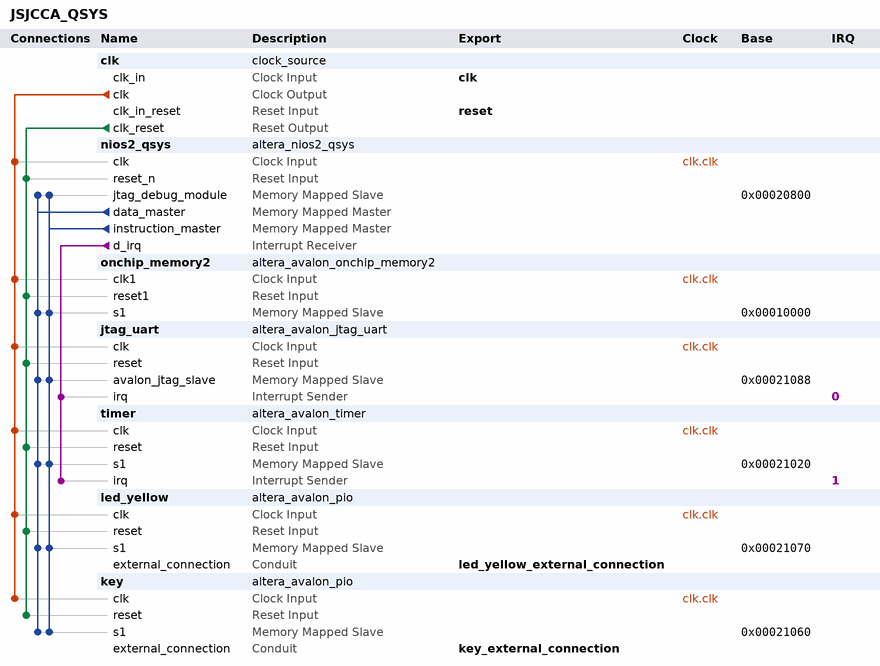
[diagram p0: system contents]
# Platform Designer (Qsys) system JSJCCA_QSYS, Cyclone IV E EP4CE6E22C8
# Parameters at their usual value, and those the tool derives, are not listed.
package require -exact qsys 13.0.1.99.2
create_system JSJCCA_QSYS
set_project_property DEVICE_FAMILY {Cyclone IV E}
set_project_property DEVICE EP4CE6E22C8

add_instance clk clock_source 13.0
set_instance_parameter_value clk clockFrequency 50000000

add_instance nios2_qsys altera_nios2_qsys 13.0
set_instance_parameter_value nios2_qsys resetSlave onchip_memory2.s1
set_instance_parameter_value nios2_qsys mmu_TLBMissExcSlave None
set_instance_parameter_value nios2_qsys exceptionSlave onchip_memory2.s1
set_instance_parameter_value nios2_qsys breakSlave nios2_qsys.jtag_debug_module
set_instance_parameter_value nios2_qsys impl Tiny
set_instance_parameter_value nios2_qsys icache_size 4096

add_instance onchip_memory2 altera_avalon_onchip_memory2 13.0.1.99.2
set_instance_parameter_value onchip_memory2 dataWidth 32
set_instance_parameter_value onchip_memory2 dualPort false
set_instance_parameter_value onchip_memory2 initMemContent true
set_instance_parameter_value onchip_memory2 initializationFileName onchip_mem.hex
set_instance_parameter_value onchip_memory2 memorySize 8960

add_instance jtag_uart altera_avalon_jtag_uart 13.0.1.99.2
set_instance_parameter_value jtag_uart simInteractiveOptions NO_INTERACTIVE_WINDOWS

add_instance timer altera_avalon_timer 13.0.1.99.2
set_instance_parameter_value timer period 1
set_instance_parameter_value timer periodUnits MSEC

add_instance led_yellow altera_avalon_pio 13.0.1.99.2
set_instance_parameter_value led_yellow direction Output
set_instance_parameter_value led_yellow width 4

add_instance key altera_avalon_pio 13.0.1.99.2
set_instance_parameter_value key direction Input
set_instance_parameter_value key width 4

# connections
add_connection clk.clk jtag_uart.clk clock
add_connection clk.clk key.clk clock
add_connection clk.clk led_yellow.clk clock
add_connection clk.clk nios2_qsys.clk clock
add_connection clk.clk onchip_memory2.clk1 clock
add_connection clk.clk timer.clk clock
add_connection clk.clk_reset jtag_uart.reset reset
add_connection clk.clk_reset key.reset reset
add_connection clk.clk_reset led_yellow.reset reset
add_connection clk.clk_reset nios2_qsys.reset_n reset
add_connection clk.clk_reset onchip_memory2.reset1 reset
add_connection clk.clk_reset timer.reset reset
add_connection nios2_qsys.data_master jtag_uart.avalon_jtag_slave avalon
set_connection_parameter_value nios2_qsys.data_master/jtag_uart.avalon_jtag_slave baseAddress 0x00021088
add_connection nios2_qsys.data_master key.s1 avalon
set_connection_parameter_value nios2_qsys.data_master/key.s1 baseAddress 0x00021060
add_connection nios2_qsys.data_master led_yellow.s1 avalon
set_connection_parameter_value nios2_qsys.data_master/led_yellow.s1 baseAddress 0x00021070
add_connection nios2_qsys.data_master nios2_qsys.jtag_debug_module avalon
set_connection_parameter_value nios2_qsys.data_master/nios2_qsys.jtag_debug_module baseAddress 0x00020800
add_connection nios2_qsys.data_master onchip_memory2.s1 avalon
set_connection_parameter_value nios2_qsys.data_master/onchip_memory2.s1 baseAddress 0x00010000
add_connection nios2_qsys.data_master timer.s1 avalon
set_connection_parameter_value nios2_qsys.data_master/timer.s1 baseAddress 0x00021020
add_connection nios2_qsys.instruction_master jtag_uart.avalon_jtag_slave avalon
set_connection_parameter_value nios2_qsys.instruction_master/jtag_uart.avalon_jtag_slave baseAddress 0x00021088
add_connection nios2_qsys.instruction_master key.s1 avalon
set_connection_parameter_value nios2_qsys.instruction_master/key.s1 baseAddress 0x00021060
add_connection nios2_qsys.instruction_master led_yellow.s1 avalon
set_connection_parameter_value nios2_qsys.instruction_master/led_yellow.s1 baseAddress 0x00021070
add_connection nios2_qsys.instruction_master nios2_qsys.jtag_debug_module avalon
set_connection_parameter_value nios2_qsys.instruction_master/nios2_qsys.jtag_debug_module baseAddress 0x00020800
add_connection nios2_qsys.instruction_master onchip_memory2.s1 avalon
set_connection_parameter_value nios2_qsys.instruction_master/onchip_memory2.s1 baseAddress 0x00010000
add_connection nios2_qsys.instruction_master timer.s1 avalon
set_connection_parameter_value nios2_qsys.instruction_master/timer.s1 baseAddress 0x00021020
add_connection nios2_qsys.d_irq jtag_uart.irq interrupt
set_connection_parameter_value nios2_qsys.d_irq/jtag_uart.irq irqNumber 0
add_connection nios2_qsys.d_irq timer.irq interrupt
set_connection_parameter_value nios2_qsys.d_irq/timer.irq irqNumber 1

# exported interfaces
add_interface clk clock sink
set_interface_property clk EXPORT_OF clk.clk_in
add_interface reset reset sink
set_interface_property reset EXPORT_OF clk.clk_in_reset
add_interface key_external_connection conduit end
set_interface_property key_external_connection EXPORT_OF key.external_connection
add_interface led_yellow_external_connection conduit end
set_interface_property led_yellow_external_connection EXPORT_OF led_yellow.external_connection

set_interconnect_requirement {$system} qsys_mm.clockCrossingAdapter HANDSHAKE
set_interconnect_requirement {$system} qsys_mm.maxAdditionalLatency 1

save_system JSJCCA_QSYS.qsys
